# EAGLE design Cahyo (EAGLE 9.5.2)
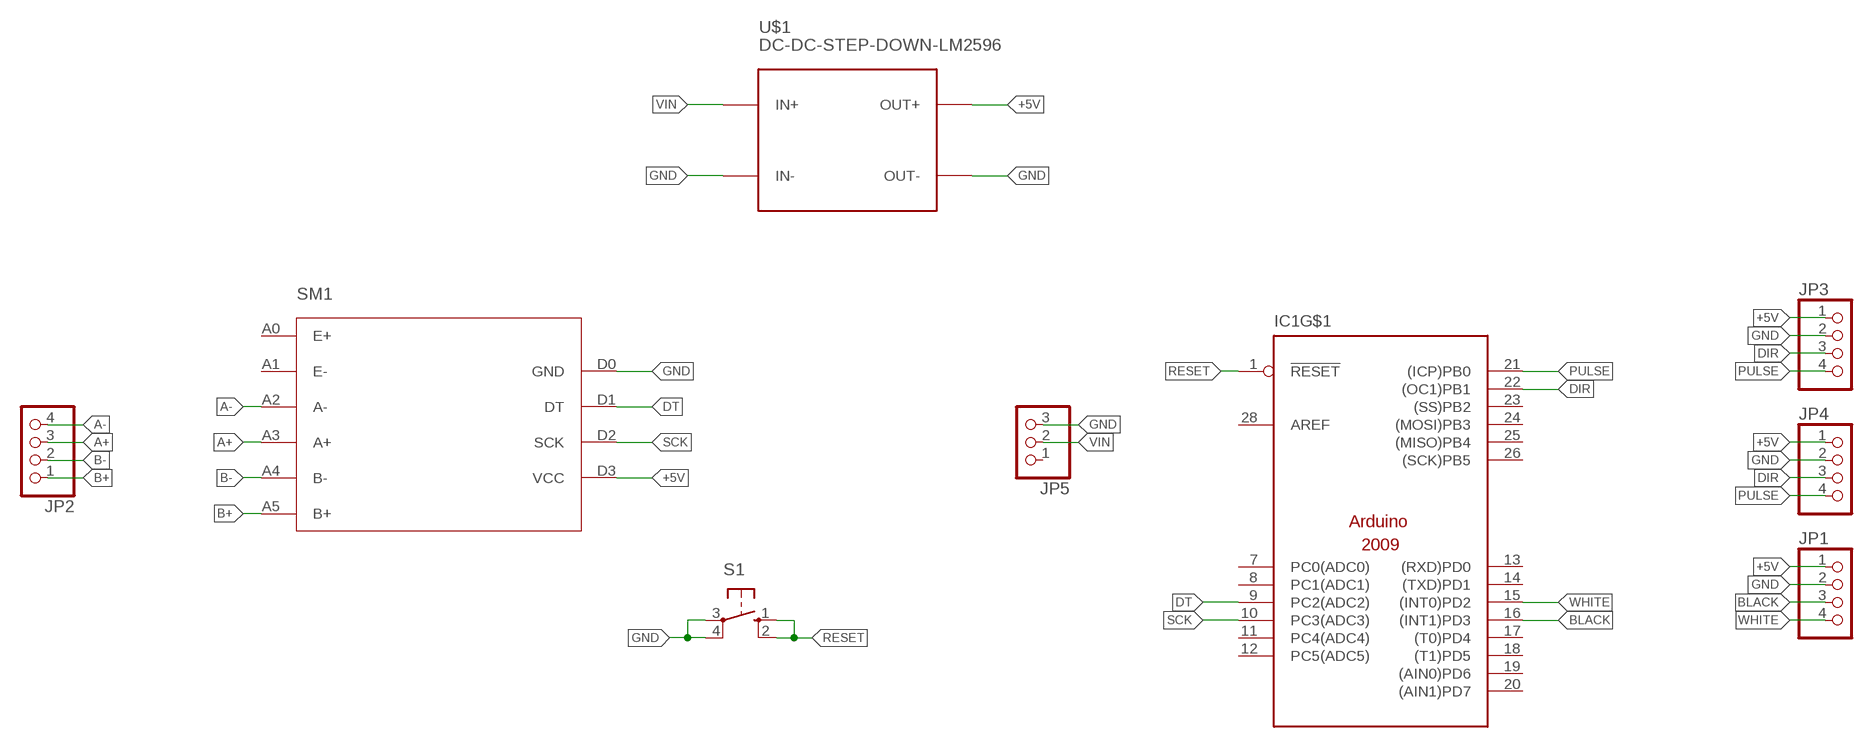
[diagram p0: schematic, sheet 1]

## Parts
IC1  ARDUINO2009_PIN_22  [ARDUINO2009_2]
JP1  PINHD-1X4  [1X04]
JP2  PINHD-1X4  [1X04]
JP3  PINHD-1X4  [1X04]
JP4  PINHD-1X4  [1X04]
JP5  PINHD-1X3  [1X03]
S1  10-XX  [B3F-10XX]
SM1  HX711  [HX711]
U$1  DC-DC-STEP-DOWN-LM2596  [DC-DC-STEP-DOWN-LM2596]

## Nets
+5V: JP1.1 JP3.1 JP4.1 SM1.D3(VCC) U$1.OUT+
A+: JP2.3 SM1.A3(A+)
A-: JP2.4 SM1.A2(A-)
B+: JP2.1 SM1.A5(B+)
B-: JP2.2 SM1.A4(B-)
BLACK: IC1.16((INT1)PD3) JP1.3
DIR: IC1.22((OC1)PB1) JP3.3 JP4.3
DT: IC1.9(PC2(ADC2)) SM1.D1(DT)
GND: JP1.2 JP3.2 JP4.2 JP5.3 S1.3(P) S1.4(P1) SM1.D0(GND) U$1.IN- U$1.OUT-
PULSE: IC1.21((ICP)PB0) JP3.4 JP4.4
RESET: IC1.1(!RESET) S1.1(S) S1.2(S1)
SCK: IC1.10(PC3(ADC3)) SM1.D2(SCK)
VIN: JP5.2 U$1.IN+
WHITE: IC1.15((INT0)PD2) JP1.4
Unconnected: IC1.7(PC0(ADC0)) IC1.8(PC1(ADC1)) IC1.11(PC4(ADC4)) IC1.12(PC5(ADC5)) IC1.13((RXD)PD0) IC1.14((TXD)PD1) IC1.17((T0)PD4) IC1.18((T1)PD5) IC1.19((AIN0)PD6) IC1.20((AIN1)PD7) IC1.23((SS)PB2) IC1.24((MOSI)PB3) IC1.25((MISO)PB4) IC1.26((SCK)PB5) IC1.28(AREF) JP5.1 SM1.A0(E+) SM1.A1(E-)

## Power pins joined to a net without a drawn wire
+3V3: IC1.2(+3V3)
+5V: IC1.3(+5V)
GND: IC1.4(GND) IC1.5(GND) IC1.27(GND)
VIN: IC1.6(+VIN)

## Library data of the parts
IC1 = arduino2:ARDUINO2009_PIN_2: The Arduino Duemilanove ("2009") is a microcontroller board based on the ATmega168 or ATmega328. - 14 digital input/output pins (of which 6 can be used as PWM outputs) - 6 analog inputs, a 16 MHz crystal oscillator - USB connection - power jack - ISP header - reset button It contains everything needed to support the microcontroller; simply connect it to a computer with a USB cable or power it with a AC-to-DC adapter or battery to get started http://arduino.cc/en/Main/ArduinoBoardDuemilanove
JP1-JP4 = pinhead-edit-molex:PINHD-1X4: PIN HEADER
JP5 = pinhead-edit-molex:PINHD-1X3: PIN HEADER
S1 = switch-omron22:10-XX: OMRON SWITCH; MPN: B3F-1000; OC_FARNELL: 176432; OC_NEWARK: 36M3542
SM1 = hx711:HX711: HX711 module is a Load Cell Amplifier breakout board for the HX711 IC that allows you to easily read load cells to measure weight. This module uses 24 high precision A/D converter chip HX711. It is a specially designed for the high precision electronic scale design, with two analog input channel, the internal integration of 128 times the programmable gain amplifier. The input circuit can be configured to provide a bridge type pressure bridge (such as pressure, weighing sensor mode), is of high precision, low cost is an ideal sampling front-end module.
U$1 = diy-modules:DC-DC-STEP-DOWN-LM2596: DC/DC Step-Down Regulator based on LM2596-ADJ chip LM2596 datasheet available here: http://www.ti.com/lit/ds/symlink/lm2596.pdf Click here to find device on ebay.com <http://www.ebay.com/sch/lm2596+power+regulator>

## Board
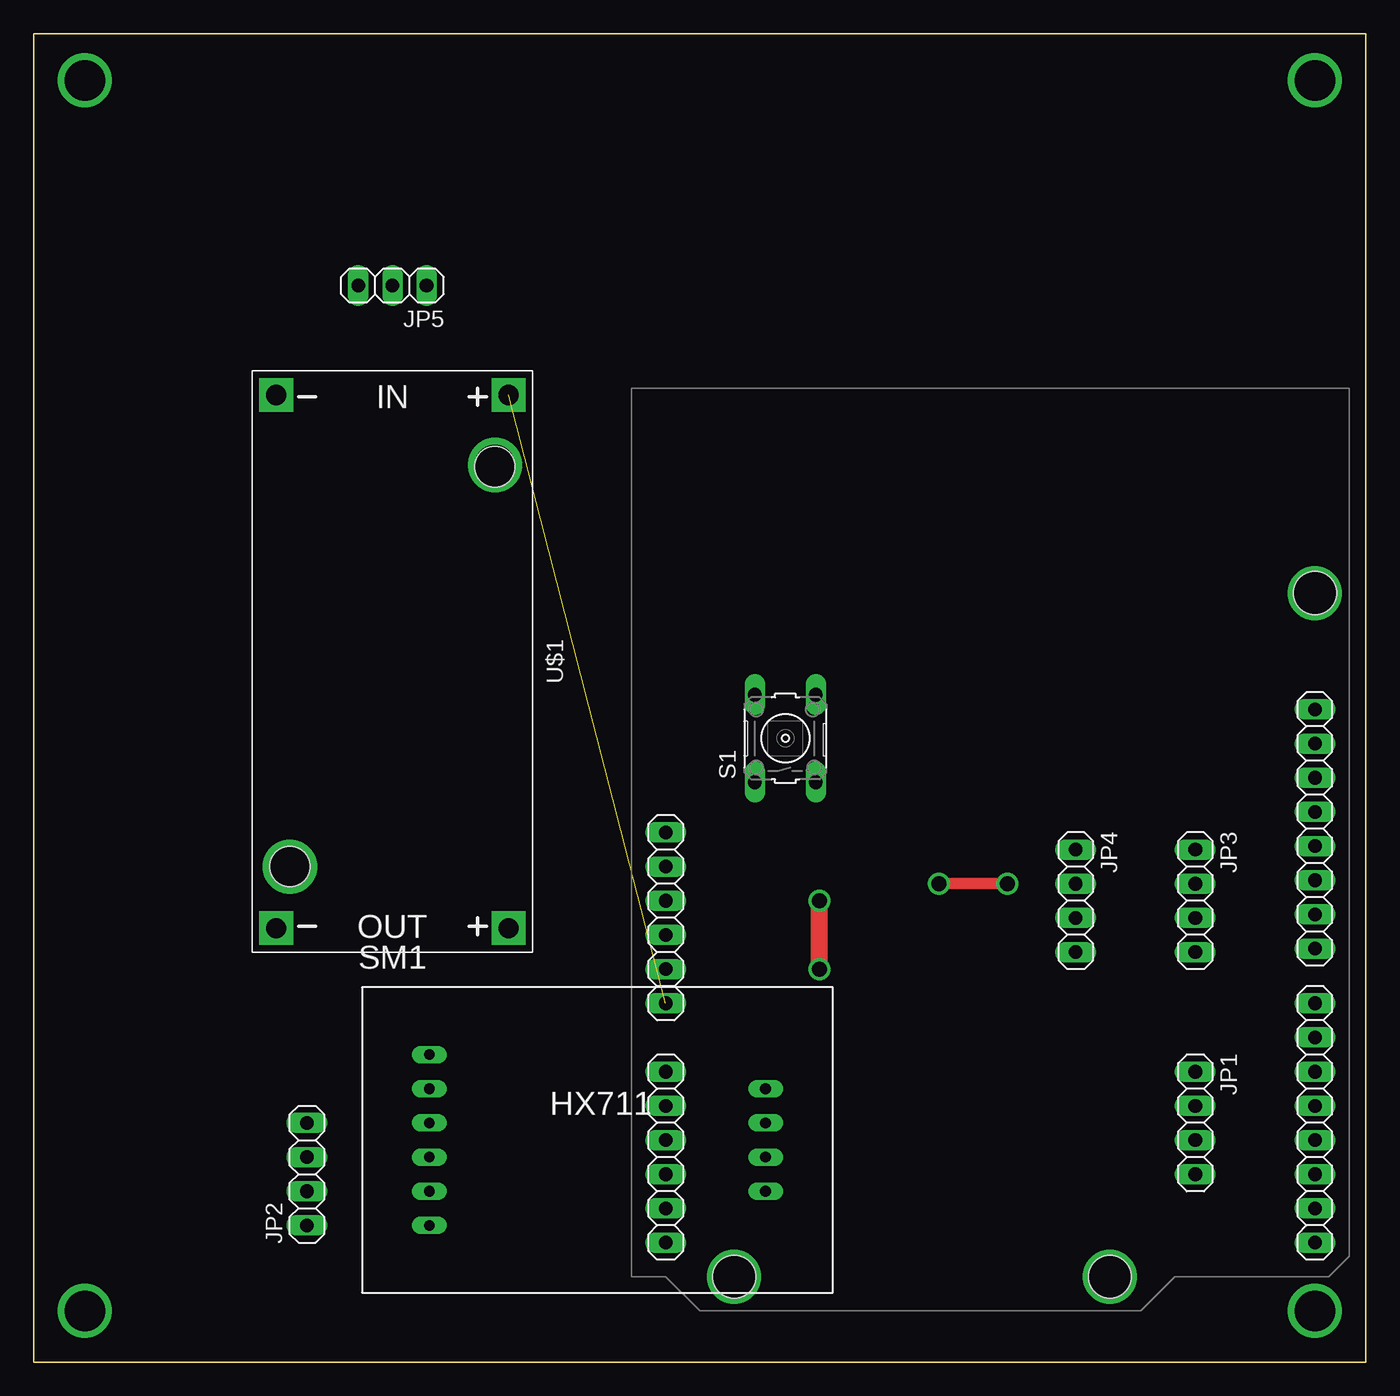
[diagram p1: board, top side]
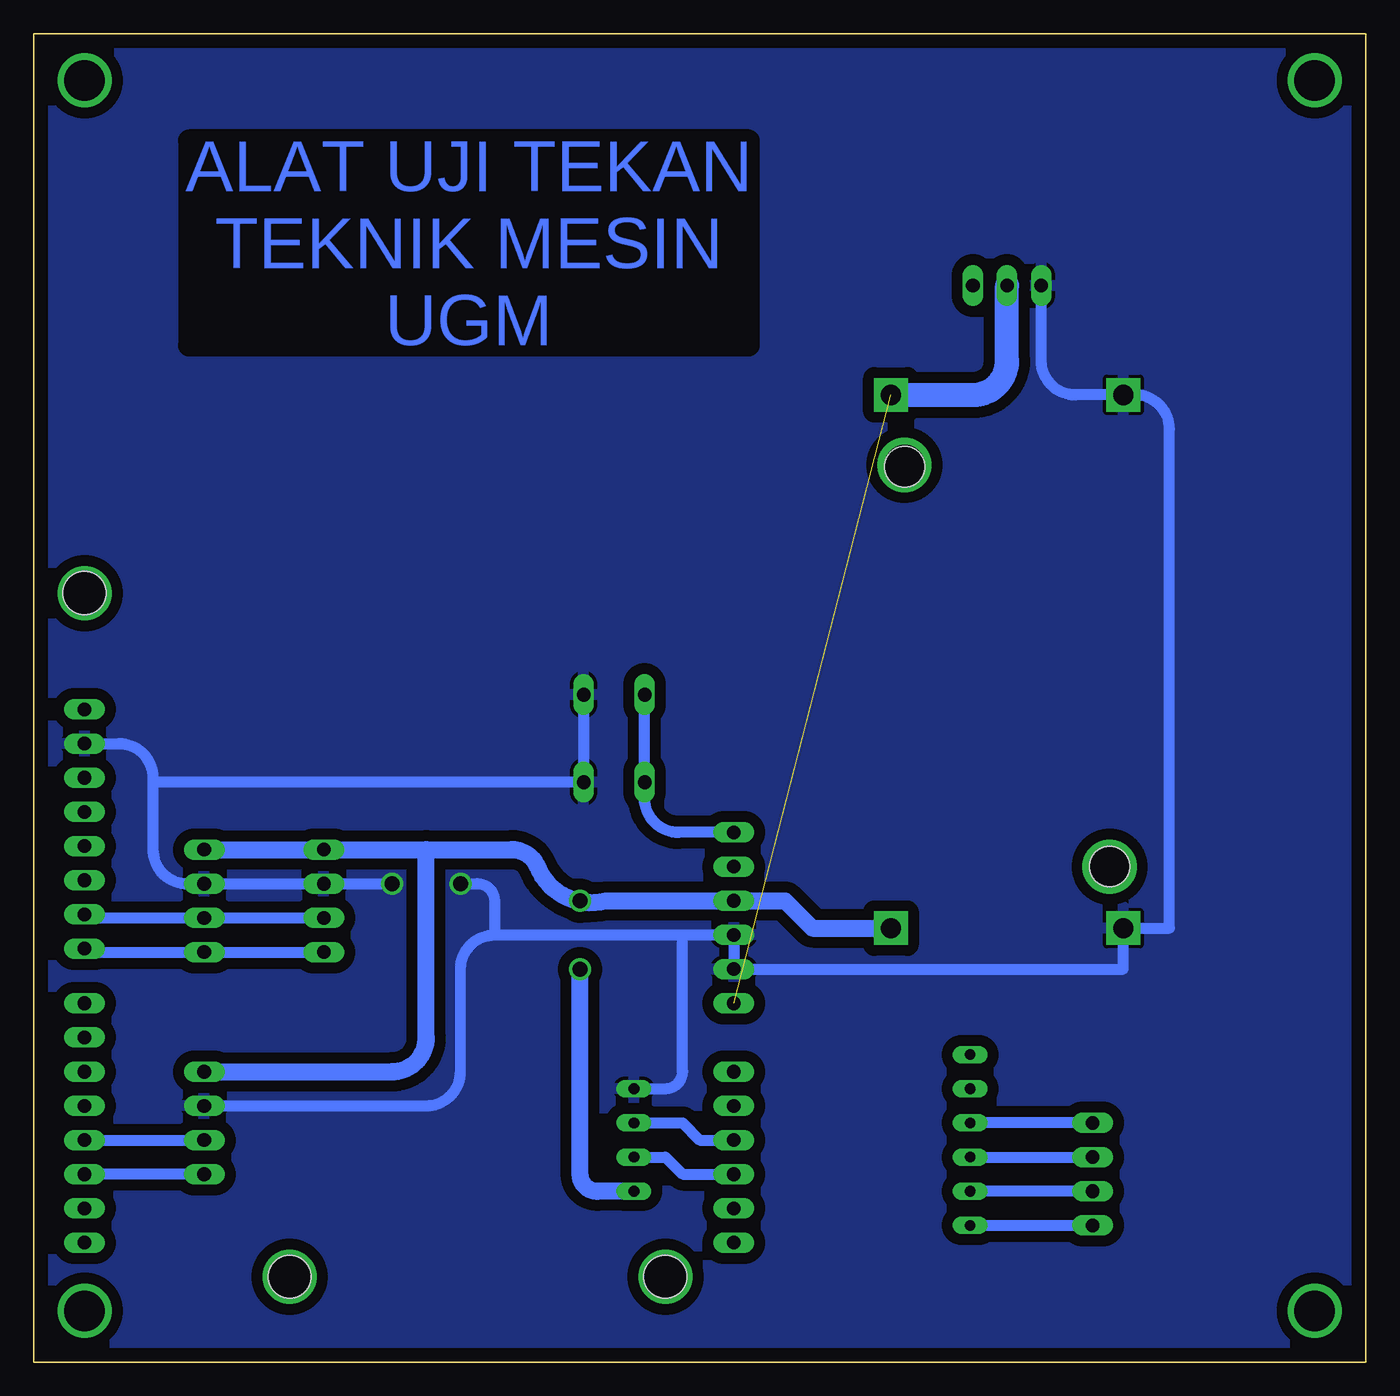
[diagram p2: board, bottom side, seen from below]

Size 99.04 x 98.73 mm. Coordinates in mm from the lower left corner, seen from the top.
Outline: 0,0 99.04,0 99.04,98.73 0,98.73 0,0
Copper layers (1*16): Top 0.035mm / dielectric 1.5mm / Bottom 0.035mm
Design rules "default": minimum track width 6mil, minimum drill 0.35mm, track to track 6mil, track to pad 6mil, pad to pad 6mil, via to via 6mil, smd to smd 6mil, copper to edge 40mil, drill to drill 6mil, minimum pad ring 10mil, minimum via ring 8mil, stop-mask expansion 4mil, vias tented up to drill 0mil, thermal gap 10mil

### Footprints (pad centres in the part's own frame; a part is rotated, then mirrored left to right if it is on the bottom)
ARDUINO2009_2 = drill 1.016 long: 1 33.02,2.54; 2 35.56,2.54; 3 38.1,2.54; 4 40.64,2.54; 5 43.18,2.54; 6 45.72,2.54; 7 50.8,2.54; 8 53.34,2.54; 9 55.88,2.54; 10 58.42,2.54; 11 60.96,2.54; 12 63.5,2.54; 13 63.5,50.8; 14 60.96,50.8; 15 58.42,50.8; 16 55.88,50.8; 17 53.34,50.8; 18 50.8,50.8; 19 48.26,50.8; 20 45.72,50.8; 21 41.656,50.8; 22 39.116,50.8; 23 36.576,50.8; 24 34.036,50.8; 25 31.496,50.8; 26 28.956,50.8; 27 26.416,50.8; 28 23.876,50.8 | hole 3.2: 15.24,50.8; 66.04,35.56; 66.04,7.62
1X04 = drill 1.016 long: 1 -3.81,0; 2 -1.27,0; 3 1.27,0; 4 3.81,0
1X03 = drill 1.016 long: 1 -2.54,0; 2 0,0; 3 2.54,0
B3F-10XX = drill 1.016 long: 1 -3.251,2.261; 2 3.251,2.261; 3 -3.251,-2.261; 4 3.251,-2.261
HX711 = drill 0.8 long: A0 -12.5,6.35; A1 -12.5,3.81; A2 -12.5,1.27; A3 -12.5,-1.27; A4 -12.5,-3.81; A5 -12.5,-6.35; D0 12.5,3.81; D1 12.5,1.27; D2 12.5,-1.27; D3 12.5,-3.81
DC-DC-STEP-DOWN-LM2596 = drill 1.5 pad 2.5 square: IN+ -19.812,8.636; IN- -19.812,-8.636; OUT+ 19.812,8.636; OUT- 19.812,-8.636 | hole 3: -14.478,7.62; 15.24,-7.62

### Placement (x,y rotation side)
IC1  44.45,72.39 270 top
JP1  86.36,17.78 270 top
JP2  20.32,13.97 90 top
JP3  86.36,34.29 270 top
JP4  77.47,34.29 270 top
JP5  26.67,80.01 180 top
S1  55.88,46.36 90 top
SM1  41.91,16.51 0 top
U$1  26.67,52.07 270 top

### Tracks (layer width: path | path; a pad name or v marks a point on that pad's centre or on a via)
+5V  (via drill 1.1)
  Top 1.27: v58.42,29.21 v58.42,34.29
  Bottom 0.813: v58.42,34.29 56.52,34.29
  Bottom 1.27: JP3.1 JP4.1 69.85,38.1 | JP1.1 72.39,21.59 arc-90 69.85,24.13 69.85,38.1 | 69.85,38.1 63.5,38.1 arc67 61.59,36.83 arc-82 56.52,34.29 IC1.3 43.18,34.29 41.15,32.26 U$1.OUT+ | SM1.D3 57.15,12.7 arc90 58.42,13.97 v58.42,29.21
A+
  Bottom 0.813: SM1.A3 JP2.3
A-
  Bottom 0.813: JP2.4 SM1.A2
B+
  Bottom 0.813: SM1.A5 JP2.1
B-
  Bottom 0.813: JP2.2 SM1.A4
BLACK
  Bottom 0.813: IC1.16 JP1.3
DIR
  Bottom 0.813: JP4.3 JP3.3 95,33.02 arc90 IC1.22
DT
  Bottom 0.813: SM1.D1 50.8,17.78 49.53,16.51 IC1.9
GND  (via drill 1.1)
  Top 0.813: v72.39,35.56 v67.31,35.56
  Bottom 0.813: IC1.27 92.71,45.97 arc90 90.17,43.43 | 90.17,43.43 90.17,38.1 arc-90 87.63,35.56 JP3.2 JP4.2 v72.39,35.56 | v67.31,35.56 66.04,35.56 arc90 64.77,34.29 64.77,31.75 | 64.77,31.75 50.8,31.75 | 50.8,31.75 IC1.4 IC1.5 18.03,29.21 U$1.OUT- 14.6,32.26 14.6,69.34 arc-90 17.15,71.88 U$1.IN- 21.59,71.88 arc90 24.13,74.42 JP5.3 | JP1.2 69.85,19.05 arc-90 67.31,21.59 67.31,29.21 arc90 64.77,31.75 | SM1.D0 52.07,20.32 arc-90 50.8,21.59 50.8,31.75 | S1.4 S1.3 89.84,43.1 arc90 90.17,43.43
  pour Bottom (isolate 0.813): 0,98.42 99.06,98.42 99.06,0 0,0
N$1  (via drill 3)
  other vias: 95.25,57.15
N$2  (via drill 3)
  other vias: 80.01,6.35
N$3  (via drill 3)
  other vias: 52.07,6.35
N$4  (via drill 3)
  other vias: 3.81,95.25
N$5  (via drill 3)
  other vias: 3.81,3.81
N$6  (via drill 3)
  other vias: 95.25,3.81
N$7  (via drill 3)
  other vias: 95.25,95.25
N$8  (via drill 3)
  other vias: 34.29,66.67
N$9  (via drill 3)
  other vias: 19.05,36.83
PULSE
  Bottom 0.813: IC1.21 arc-90 95,30.48 JP3.4 JP4.4
RESET
  Bottom 0.813: IC1.1 51.08,39.37 arc90 53.62,41.91 S1.1 S1.2
SCK
  Bottom 0.813: SM1.D2 52.07,15.24 50.8,13.97 IC1.10
VIN  (1 unrouted)
  Bottom 1.8: U$1.IN+ 29.21,71.88 arc-90 26.67,74.42 JP5.2
WHITE
  Bottom 0.813: JP1.4 IC1.15

### Text on the board
Bottom: ALAT UJI TEKAN / TEKNIK MESIN / UGM